# Altium schematic sheet FFT_IFFT.SchDoc
size A2
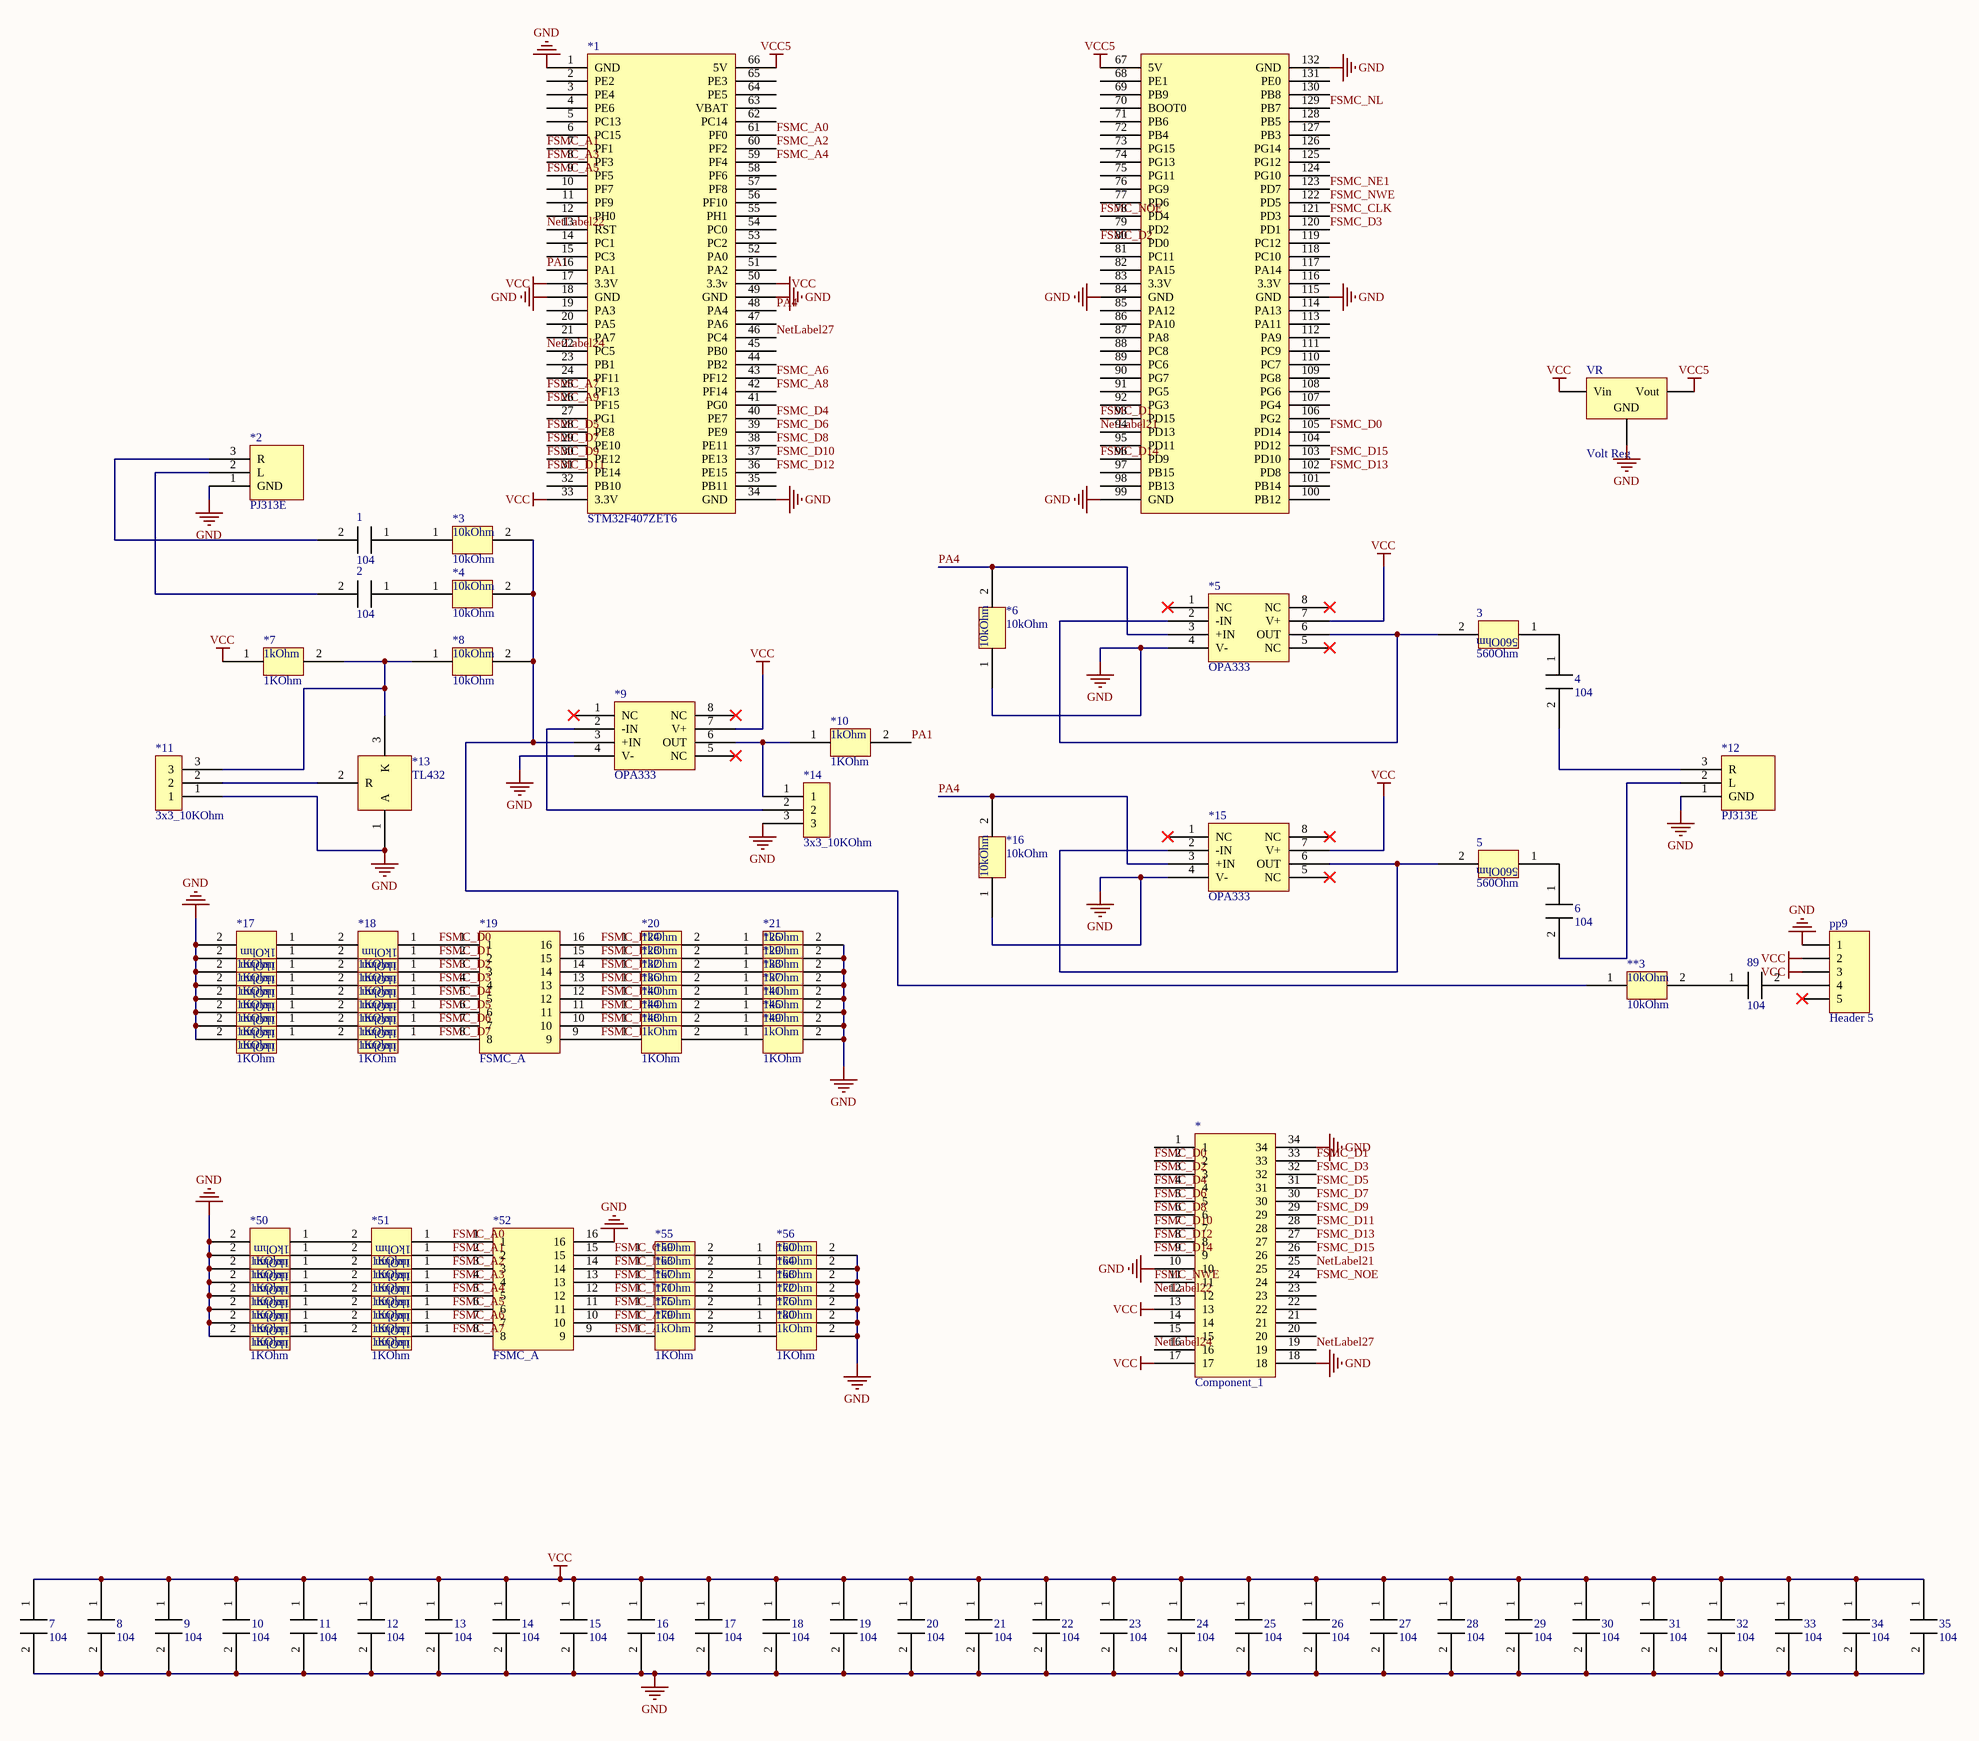
[diagram p0: FFT_IFFT.SchDoc]

## Parts
1  104  [104]
2  104  [104]
3  560Ohm  [104]
4  104  [104]
5  560Ohm  [104]
6  104  [104]
7  104  [104]
8  104  [104]
9  104  [104]
10  104  [104]
11  104  [104]
12  104  [104]
13  104  [104]
14  104  [104]
15  104  [104]
16  104  [104]
17  104  [104]
18  104  [104]
19  104  [104]
20  104  [104]
21  104  [104]
22  104  [104]
23  104  [104]
24  104  [104]
25  104  [104]
26  104  [104]
27  104  [104]
28  104  [104]
29  104  [104]
30  104  [104]
31  104  [104]
32  104  [104]
33  104  [104]
34  104  [104]
35  104  [104]
89  104  [104]
*  Component_1  [PCBComponent_1]
*1  STM32F407ZET6  [STM32F407ZET6]
*2  PJ313E  [PJ313E]
*3  10kOhm  [104]
*4  10kOhm  [104]
*5  OPA333  [OPA333]
*6  10kOhm  [104]
*7  1KOhm  [104]
*8  10kOhm  [104]
*9  OPA333  [OPA333]
*10  1KOhm  [104]
*11  3x3_10KOhm  [3x3_10KOhm]
*12  PJ313E  [PJ313E]
*13  TL432  [AO3401]
*14  3x3_10KOhm  [3x3_10KOhm]
*15  OPA333  [OPA333]
*16  10kOhm  [104]
*17  1KOhm  [104]
*18  1KOhm  [104]
*19  FSMC_A  [DIP32]
*20  1KOhm  [104]
*21  1KOhm  [104]
*22  1KOhm  [104]
*23  1KOhm  [104]
*24  1KOhm  [104]
*25  1KOhm  [104]
*26  1KOhm  [104]
*27  1KOhm  [104]
*28  1KOhm  [104]
*29  1KOhm  [104]
*30  1KOhm  [104]
*31  1KOhm  [104]
*32  1KOhm  [104]
*33  1KOhm  [104]
*34  1KOhm  [104]
*35  1KOhm  [104]
*36  1KOhm  [104]
*37  1KOhm  [104]
*38  1KOhm  [104]
*39  1KOhm  [104]
*40  1KOhm  [104]
*41  1KOhm  [104]
*42  1KOhm  [104]
*43  1KOhm  [104]
*44  1KOhm  [104]
*45  1KOhm  [104]
*46  1KOhm  [104]
*47  1KOhm  [104]
*48  1KOhm  [104]
*49  1KOhm  [104]
*50  1KOhm  [104]
*51  1KOhm  [104]
*52  FSMC_A  [DIP32]
*53  1KOhm  [104]
*54  1KOhm  [104]
*55  1KOhm  [104]
*56  1KOhm  [104]
*57  1KOhm  [104]
*58  1KOhm  [104]
*59  1KOhm  [104]
*60  1KOhm  [104]
*61  1KOhm  [104]
*62  1KOhm  [104]
*63  1KOhm  [104]
*64  1KOhm  [104]
*65  1KOhm  [104]
*66  1KOhm  [104]
*67  1KOhm  [104]
*68  1KOhm  [104]
*69  1KOhm  [104]
*70  1KOhm  [104]
*71  1KOhm  [104]
*72  1KOhm  [104]
*73  1KOhm  [104]
*74  1KOhm  [104]
*75  1KOhm  [104]
*76  1KOhm  [104]
*77  1KOhm  [104]
*78  1KOhm  [104]
*79  1KOhm  [104]
*80  1KOhm  [104]
**3  10kOhm  [104]
pp9  Header 5  [HDR1X5]
VR  Volt Reg  [TO252]

## Nets
GND: 7.2 8.2 9.2 10.2 11.2 12.2 13.2 14.2 15.2 16.2 17.2 18.2 19.2 20.2 21.2 22.2 23.2 24.2 25.2 26.2 27.2 28.2 29.2 30.2 31.2 32.2 33.2 34.2 35.2 *.10 *.18 *.34 *1.1(GND) *1.18(GND) *1.34(GND) *1.49(GND) *1.84(GND) *1.99(GND) *1.115(GND) *1.132(GND) *2.1(GND) *5.4(V-) *6.1 *9.4(V-) *11.1 *12.1(GND) *13.1(A) *14.3 *15.4(V-) *16.1 *17.2 *21.2 *22.2 *25.2 *26.2 *29.2 *30.2 *33.2 *34.2 *37.2 *38.2 *41.2 *42.2 *45.2 *46.2 *49.2 *50.2 *52.16 *53.2 *56.2 *57.2 *60.2 *61.2 *64.2 *65.2 *68.2 *69.2 *72.2 *73.2 *76.2 *77.2 *80.2 pp9.1 VR.2(GND)
VCC: 7.1 8.1 9.1 10.1 11.1 12.1 13.1 14.1 15.1 16.1 17.1 18.1 19.1 20.1 21.1 22.1 23.1 24.1 25.1 26.1 27.1 28.1 29.1 30.1 31.1 32.1 33.1 34.1 35.1 *.13 *.17 *1.17(3.3V) *1.33(3.3V) *1.50(3.3v) *5.7(V+) *7.1 *9.7(V+) *15.7(V+) pp9.2 pp9.3 VR.1(Vin)
VCC5: *1.66(5V) *1.67(5V) VR.3(Vout)
FSMC_A0: *1.61(PF0) *51.1 *52.1
FSMC_A1: *1.7(PF1) *52.2 *54.1
FSMC_A2: *1.60(PF2) *52.3 *58.1
FSMC_A3: *1.8(PF3) *52.4 *62.1
FSMC_A4: *1.59(PF4) *52.5 *66.1
FSMC_A5: *1.9(PF5) *52.6 *70.1
FSMC_A6: *1.43(PF12) *52.7 *74.1
FSMC_A7: *1.25(PF13) *52.8 *78.1
FSMC_A8: *1.42(PF14) *52.9 *79.1
FSMC_A9: *1.26(PF15) *52.10 *75.1
FSMC_CLK: *1.121(PD3) *52.15 *55.1
FSMC_D0: *.2 *1.105(PD14) *18.1 *19.1
FSMC_D1: *.33 *1.93(PD15) *19.2 *23.1
FSMC_D2: *.3 *1.80(PD0) *19.3 *27.1
FSMC_D3: *.32 *1.120(PD1) *19.4 *31.1
FSMC_D4: *.4 *1.40(PE7) *19.5 *35.1
FSMC_D5: *.31 *1.28(PE8) *19.6 *39.1
FSMC_D6: *.5 *1.39(PE9) *19.7 *43.1
FSMC_D7: *.30 *1.29(PE10) *19.8 *47.1
FSMC_D8: *.6 *1.38(PE11) *19.9 *48.1
FSMC_D9: *.29 *1.30(PE12) *19.10 *44.1
FSMC_D10: *.7 *1.37(PE13) *19.11 *40.1
FSMC_D11: *.28 *1.31(PE14) *19.12 *36.1
FSMC_D12: *.8 *1.36(PE15) *19.13 *32.1
FSMC_D13: *.27 *1.102(PD8) *19.14 *28.1
FSMC_D14: *.9 *1.96(PD9) *19.15 *24.1
FSMC_D15: *.26 *1.103(PD10) *19.16 *20.1
FSMC_NE1: *1.123(PD7) *52.12 *67.1
FSMC_NL: *1.129(PB7) *52.11 *71.1
FSMC_NOE: *.24 *1.78(PD4) *52.14 *59.1
FSMC_NWE: *.11 *1.122(PD5) *52.13 *63.1
NetLabel21: *.25 *1.94(PD13)
NetLabel22: *.12 *1.13(RST)
NetLabel24: *.16 *1.22(PC5)
NetLabel27: *.19 *1.46(PC4)
PA1: *1.16(PA1) *10.2
PA4: *1.48(PA4) *5.3(+IN) *6.2 *15.3(+IN) *16.2
Net1_1: 1.1 *3.1
Net1_2: 1.2 *2.3(R)
Net2_1: 2.1 *4.1
Net2_2: 2.2 *2.2(L)
Net3_1: 3.1 4.1
Net3_2: 3.2 *5.2(-IN) *5.6(OUT)
Net4_2: 4.2 *12.3(R)
Net5_1: 5.1 6.1
Net5_2: 5.2 *15.2(-IN) *15.6(OUT)
Net6_2: 6.2 *12.2(L)
Net89_1: 89.1 **3.2
Net89_2: 89.2 pp9.4
Net*3_2: *3.2 *4.2 *8.2 *9.3(+IN) **3.1
Net*7_2: *7.2 *8.1 *11.3 *13.3(K)
Net*9_2: *9.2(-IN) *14.2
Net*9_6: *9.6(OUT) *10.1 *14.1
Net*11_2: *11.2 *13.2(R)
Net*17_1: *17.1 *18.2
Net*20_2: *20.2 *21.1
Net*22_1: *22.1 *23.2
Net*24_2: *24.2 *25.1
Net*26_1: *26.1 *27.2
Net*28_2: *28.2 *29.1
Net*30_1: *30.1 *31.2
Net*32_2: *32.2 *33.1
Net*34_1: *34.1 *35.2
Net*36_2: *36.2 *37.1
Net*38_1: *38.1 *39.2
Net*40_2: *40.2 *41.1
Net*42_1: *42.1 *43.2
Net*44_2: *44.2 *45.1
Net*46_1: *46.1 *47.2
Net*48_2: *48.2 *49.1
Net*50_1: *50.1 *51.2
Net*53_1: *53.1 *54.2
Net*55_2: *55.2 *56.1
Net*57_1: *57.1 *58.2
Net*59_2: *59.2 *60.1
Net*61_1: *61.1 *62.2
Net*63_2: *63.2 *64.1
Net*65_1: *65.1 *66.2
Net*67_2: *67.2 *68.1
Net*69_1: *69.1 *70.2
Net*71_2: *71.2 *72.1
Net*73_1: *73.1 *74.2
Net*75_2: *75.2 *76.1
Net*77_1: *77.1 *78.2
Net*79_2: *79.2 *80.1

Not connected (* = marked no-connect by the designer): * 1 14 15 20 21 22 23; *1 2(PE2) 3(PE4) 4(PE6) 5(PC13) 6(PC15) 10(PF7) 11(PF9) 12(PH0) 14(PC1) 15(PC3) 19(PA3) 20(PA5) 21(PA7) 23(PB1) 24(PF11) 27(PG1) 32(PB10) 35(PB11) 41(PG0) 44(PB2) 45(PB0) 47(PA6) 51(PA2) 52(PA0) 53(PC2) 54(PC0) 55(PH1) 56(PF10) 57(PF8) 58(PF6) 62(PC14) 63(VBAT) 64(PE5) 65(PE3) 68(PE1) 69(PB9) 70(BOOT0) 71(PB6) 72(PB4) 73(PG15) 74(PG13) 75(PG11) 76(PG9) 77(PD6) 79(PD2) 81(PC11) 82(PA15) 83(3.3V) 85(PA12) 86(PA10) 87(PA8) 88(PC8) 89(PC6) 90(PG7) 91(PG5) 92(PG3) 95(PD11) 97(PB15) 98(PB13) 100(PB12) 101(PB14) 104(PD12) 106(PG2) 107(PG4) 108(PG6) 109(PG8) 110(PC7) 111(PC9) 112(PA9) 113(PA11) 114(PA13) 116(3.3V) 117(PA14) 118(PC10) 119(PC12) 124(PG10) 125(PG12) 126(PG14) 127(PB3) 128(PB5) 130(PB8) 131(PE0); *5 1(NC)* 5(NC)* 8(NC)*; *9 1(NC)* 5(NC)* 8(NC)*; *15 1(NC)* 5(NC)* 8(NC)*; pp9 5*

## Notes on the sheet
- (in symbol 1KOhm) 1kOhm

## Library data of the parts
pp9 = Header 5: Header, 5-Pin; LatestRevisionDate: 17-Jul-2002; LatestRevisionNote: Re-released for DXP Platform.; Publisher: Altium Limited
VR = Volt Reg: Voltage Regulator; Published: 24-Mar-1999; LatestRevisionDate: 29-May-2009; LatestRevisionNote: IPC-7351 Footprint Added.; PackageReference: D2PAK; Publisher: Altium Limited; PackageDescription: 3-Pin Transistor Outline Package 2.54 mm Pitch, 15.1 mm Lead Span